# Altium project pcb1.PrjPcb
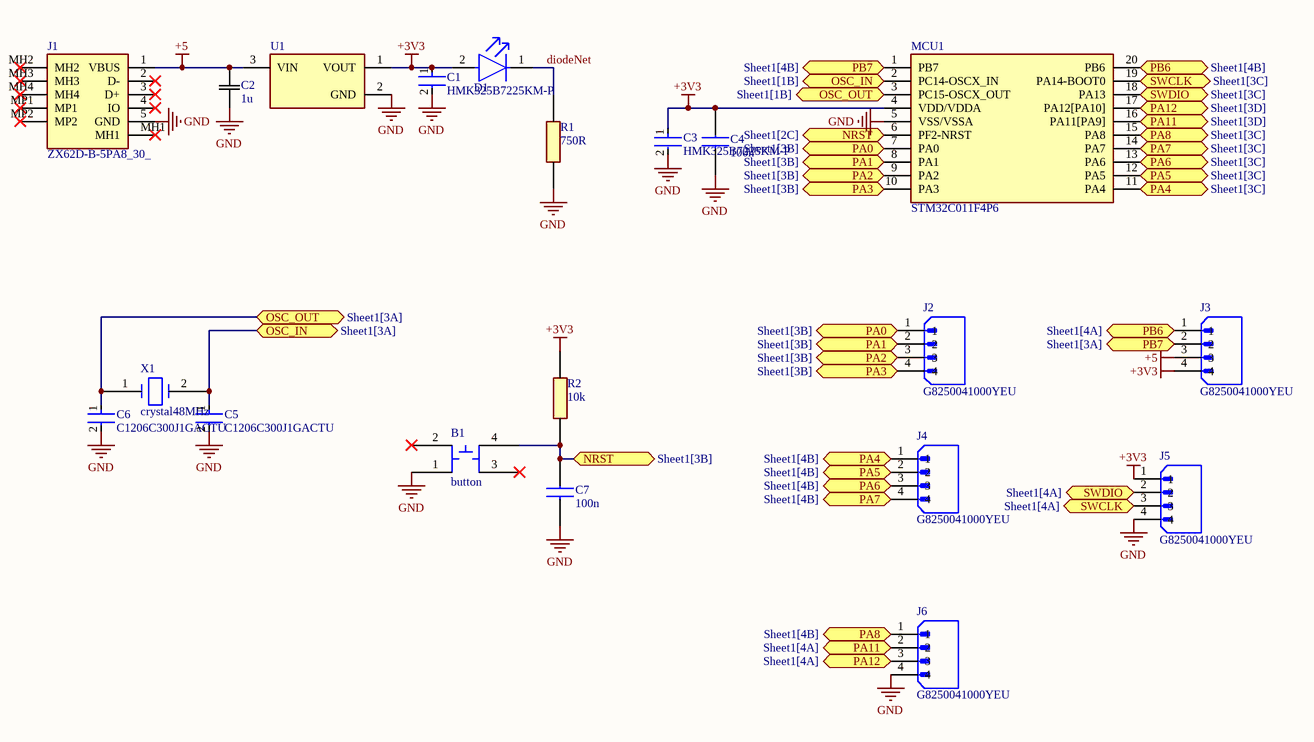
[diagram p0: Sheet1.SchDoc]
1 sheet, 20 parts. Net scope: flat (ports and power ports of the same name join across sheets).
Board file: PCB2.PcbDoc

## Sheet Sheet1.SchDoc
size A4; SheetNumber: 1; SheetTotal: 1

### Parts
B1  button  [buttonf]
C1  HMK325B7225KM-P  [FP-1210-L_3_2_0_3-W_2_5_0-IPC_B]
C2  1u  [CAPC340180_180N_KEM]
C3  HMK325B7225KM-P  [FP-1210-L_3_2_0_3-W_2_5_0-IPC_B]
C4  100n  [CAPC3216X178N]
C5  C1206C300J1GACTU  [FP-C1206C-EB-MFG]
C6  C1206C300J1GACTU  [FP-C1206C-EB-MFG]
C7  100n  [CAPC3216X178N]
D1  APT3216LSECK/J4-PRV  [FP-APT3216LSECK-J4-PRV-MFG]  (value not drawn)
J1  ZX62D-B-5PA8_30_  [ZX62DB5PA830]
J2  G8250041000YEU  [AMPHENOL_G8250041000YEU]
J3  G8250041000YEU  [AMPHENOL_G8250041000YEU]
J4  G8250041000YEU  [AMPHENOL_G8250041000YEU]
J5  G8250041000YEU  [AMPHENOL_G8250041000YEU]
J6  G8250041000YEU  [AMPHENOL_G8250041000YEU]
MCU1  STM32C011F4P6  [SOP65P640X120-20N]
R1  750R  [RESC3216X60N]
R2  10k  [RESC3225X60N]
U1  AP7381-33Y-13  [FP-SOT89-MFG]  (value not drawn)
X1  crystal48MHz  [crystal48MHzf]

### Ports
NRST (bidir, see Sheet1[2C]), NRST (bidir, see Sheet1[3B]), OSC_IN (bidir, see Sheet1[1B]), OSC_IN (bidir, see Sheet1[3A]), OSC_OUT (bidir, see Sheet1[1B]), OSC_OUT (bidir, see Sheet1[3A]), PA0 (bidir, see Sheet1[3B]), PA1 (bidir, see Sheet1[3B]), PA2 (bidir, see Sheet1[3B]), PA3 (bidir, see Sheet1[3B]), PA4 (bidir, see Sheet1[3C]), PA4 (bidir, see Sheet1[4B]), PA5 (bidir, see Sheet1[3C]), PA5 (bidir, see Sheet1[4B]), PA6 (bidir, see Sheet1[3C]), PA6 (bidir, see Sheet1[4B]), PA7 (bidir, see Sheet1[3C]), PA7 (bidir, see Sheet1[4B]), PA8 (bidir, see Sheet1[3C]), PA8 (bidir, see Sheet1[4B]), PA11 (bidir, see Sheet1[3D]), PA11 (bidir, see Sheet1[4A]), PA12 (bidir, see Sheet1[3D]), PA12 (bidir, see Sheet1[4A]), PB6 (bidir, see Sheet1[4A]), PB6 (bidir, see Sheet1[4B]), PB7 (bidir, see Sheet1[3A]), PB7 (bidir, see Sheet1[4B]), SWCLK (bidir, see Sheet1[3C]), SWCLK (bidir, see Sheet1[4A]), SWDIO (bidir, see Sheet1[3C]), SWDIO (bidir, see Sheet1[4A])

### Nets
+3V3: C1.1 C3.1 C4.1 D1.2(A) J3.4 J5.1 MCU1.4(VDD/VDDA) R2.2 U1.1(VOUT)
+5: C2.1 J1.1(VBUS) J3.3 U1.3(VIN)
GND: B1.1 C1.2 C2.2 C3.2 C4.2 C5.2 C6.2 C7.2 J1.5(GND) J5.4 J6.4 MCU1.5(VSS/VSSA) R1.2 U1.2(GND)
diodeNet: D1.1(C) R1.1
NRST: B1.4 C7.1 MCU1.6(PF2-NRST) R2.1 ; port NRST
OSC_IN: C5.1 MCU1.2(PC14-OSCX_IN) X1.2 ; port OSC_IN
OSC_OUT: C6.1 MCU1.3(PC15-OSCX_OUT) X1.1 ; port OSC_OUT
PA0: J2.1 MCU1.7(PA0) ; port PA0
PA1: J2.2 MCU1.8(PA1) ; port PA1
PA2: J2.3 MCU1.9(PA2) ; port PA2
PA3: J2.4 MCU1.10(PA3) ; port PA3
PA4: J4.1 MCU1.11(PA4) ; port PA4
PA5: J4.2 MCU1.12(PA5) ; port PA5
PA6: J4.3 MCU1.13(PA6) ; port PA6
PA7: J4.4 MCU1.14(PA7) ; port PA7
PA8: J6.1 MCU1.15(PA8) ; port PA8
PA11: J6.2 MCU1.16(PA11[PA9]) ; port PA11
PA12: J6.3 MCU1.17(PA12[PA10]) ; port PA12
PB6: J3.1 MCU1.20(PB6) ; port PB6
PB7: J3.2 MCU1.1(PB7) ; port PB7
SWCLK: J5.3 MCU1.19(PA14-BOOT0) ; port SWCLK
SWDIO: J5.2 MCU1.18(PA13) ; port SWDIO

Not connected (* = marked no-connect by the designer): B1 2* 3*; J1 2(D-)* 3(D+)* 4(IO)* MH1* MH2* MH3* MH4* MP1* MP2*

### Library data of the parts
C1 C3 = CMP-14477-002986-2: None; Dielectric: X7R; Tolerance: 10%; Capacitance: 2.2uF; RoHS Compliant: Yes; Max Operating Temperature: 125°C; Length: 3.2mm; Mount: Surface Mount; Min Operating Temperature: -55°C; Termination: Wraparound; Contact Plating: Tin; Case/Package: Ceramic
C2 = C1206F105K5RAC7800: Mfr_Name: Kemet
C4 C7 = 12062C104JAT2A: Cap Ceramic 0.1uF 200V X7R 5% Pad SMD 1206 125C T/R. 12062C104JAT2A; Manufacturer_Name: Kyocera AVX; Geometry.Height: 1.78mm; Mouser Part Number: 581-12062C104JAT2A; Mouser Price/Stock: https://www.mouser.co.uk/ProductDetail/AVX/12062C104JAT2A?qs=ZBeOGGPQgEEapHNxb9gG6A%3D%3D; Manufacturer_Part_Number: 12062C104JAT2A; Datasheet Link: https://datasheets.avx.com/X7RDielectric.pdf
C5 C6 = CMP-1037-01110-2: Cap Ceramic 30pF 100V C0G 5% SMD 1206 125°C Plastic T/R; Manufacturer: KEMET; Tolerance: 0.05; Temperature Coefficient: 15%; Automotive Grade: Grade 0; Package: C1206C-EB; Temperature Range High: +150°C; Temperature: -55°C to +150°C; Mouser Description: Cap Ceramic 30pF 100V C0G 5% SMD 1206 125°C Plastic T/R; Lead Free: Yes; RoHS: TRUE; Ipc Land Pattern Name: CAPC320160X78; Temperature Characteristic: C0G; Automotive: Yes; Temperature Range Low: -55°C; ComponentLink2URL: https://content.kemet.com/datasheets/KEM_C1007_X8R_ULTRA_150C_SMD.pdf; Device Class L1: Passive Components; Device Class L2: Capacitors; Height: 0.88mm; Digikey Description: Cap Ceramic 30pF 100V C0G 5% SMD 1206 125°C Plastic T/R; ComponentLink2Description: Datasheet; Material: Ceramic; Device Class L3: Ceramic Capacitors; Manufacturer Part Number: C1206C300J1GACTU; Category: Cap; Octopart: https://octopart.com/c1206c300j1gactu-kemet-16861015; Voltage Rating: 100 V; Value: 30 pF; Capacitance: 30 pF
D1 = CMP-44529-000067-1: LED ORANGE CLEAR 2SMD; Lens Color: Colorless; Viewing Angle: 120°; Test Current: 2mA; Forward Voltage: 1.8V; Luminous Intensity: 50mcd; Dominant Wavelength: 605nm; Case/Package: 1206; Length: 3.2mm; Width: 1.6mm; Case Code (Imperial): 1206; Mount: Surface Mount; RoHS Compliant: Yes; Lens Transparency: Clear; Case Code (Metric): 3216; Packaging: Tape and Reel; Height: 0.75mm; Color: Orange
J1 = ZX62D-B-5PA8_30_: USB - micro B USB 2.0 Receptacle Connector 5 Position Surface Mount, Right Angle; Through Hole; Manufacturer_Name: Hirose; Manufacturer_Part_Number: ZX62D-B-5PA8(30); Geometry.Height: 3mm; Mouser Part Number: 798-ZX62D-B-5PA830; Mouser Price/Stock: https://www.mouser.co.uk/ProductDetail/Hirose-Connector/ZX62D-B-5PA830?qs=1Nn7v2rJFSJs6IftS%252BmZAw%3D%3D; Datasheet Link: https://www.hirose.com/en/product/document?clcode=CL0242-0056-3-30&productname=ZX62D-B-5PA8(30)&series=ZX&documenttype=2DDrawing&lang=en&documentid=0001147958
J2-J6 = G8250041000YEU: Board mount - Header Plug - Pin Header 2.0mm Pitch Vertical,1x4Pin,Gold Flash,LCP,4.0mm*2.0mm*2.8mm; MF: Amphenol ICC (Commercial Products); Value: *; MP: G8250041000YEU; Package: None; Availability: In Stock; Price: None; SnapEDA_Link: https://www.snapeda.com/parts/G8250041000YEU/Amphenol+Commercial+Products/view-part/?ref=snap; Check_prices: https://www.snapeda.com/parts/G8250041000YEU/Amphenol+Commercial+Products/view-part/?ref=eda; Purchase-URL: https://pricing.snapeda.com/search/part/G8250041000YEU/?ref=eda
MCU1 = STM32C011F4P6: ARM Cortex-M0+ STM32L0 Microcontroller IC 32-Bit Single-Core 32MHz 16KB (16K x 8) FLASH 20-TSSOP; Manufacturer_Name: STMicroelectronics; Geometry.Height: 1.2mm; Manufacturer_Part_Number: STM32C011F4P6; Mouser Part Number: 511-STM32C011F4P6; Mouser Price/Stock: https://www.mouser.co.uk/ProductDetail/STMicroelectronics/STM32C011F4P6?qs=IPgv5n7u5Qbo1GzhbgPEPw%3D%3D; Arrow Part Number: *; Arrow Price/Stock: *; Datasheet Link: https://www.st.com/resource/en/datasheet/stm32c011d6.pdf
R1 = CRCW1206750RJNTA: Lead (Pb)-Bearing Thick Film, Rectangular Chip Resistors. 750R. CRCW1206750RJNTA; Manufacturer_Name: Vishay; Geometry.Height: 0.6mm; Mouser Part Number: *; Mouser Price/Stock: *; Manufacturer_Part_Number: CRCW1206750RJNTA; Datasheet Link: https://www.mouser.co.uk/datasheet/2/427/dcrcw-72725.pdf
R2 = CRCW121010K0JNEAIF: 10 kOhms +/-5% 0.5W, 1/2W Chip Resistor 1210 (3225 Metric) Automotive AEC-Q200, Pulse Withstanding Thick Film. CRCW121010K0JNEAIF; Manufacturer_Name: Vishay; Geometry.Height: 0.6mm; Mouser Part Number: *; Mouser Price/Stock: *; Manufacturer_Part_Number: CRCW121010K0JNEAIF; Datasheet Link: https://www.vishay.com/docs/20024/dcrcwife3.pdf
U1 = CMP-12756-000003-1: IC REG LINEAR 3.3V 150MA SOT89; Manufacturer: Diodes Inc.; Max Supply Voltage: 40V; Nominal Supply Current: 2.5-25uA; Max Junction Temp: +125°C; Number Of Outputs: 1; Output Type: Fixed; Dropout Voltage: 1000mV; Ambient Temperature Range High: +85°C; Temperature: -40°C to +125°C; Digikey Description: IC REG LINEAR 3.3V 150MA SOT89; Footprint Url: https://www.diodes.com/assets/Package-Files/SOT89.pdf; Output Voltage: 3.3V; Device Class L2: Power Management ICs; Device Class L1: Integrated Circuits (ICs); Lead Free: Yes; Automotive: No; Height: 1.6mm; Package: SOT89; Octopart: https://octopart.com/ap7381-33y-13-diodes+inc.-87775115; RoHS: TRUE; Output Current: 150mA; Temperature Range High: +125°C; Device Class L3: Voltage Regulators - Linear; Ambient Temperature Range Low: -40°C; Temperature Range Low: -40°C; Category: IC; ComponentLink2URL: https://www.diodes.com/assets/Datasheets/AP7381.pdf; ComponentLink2Description: Datasheet; Min Supply Voltage: 3.3V; Manufacturer Part Number: AP7381-33Y-13